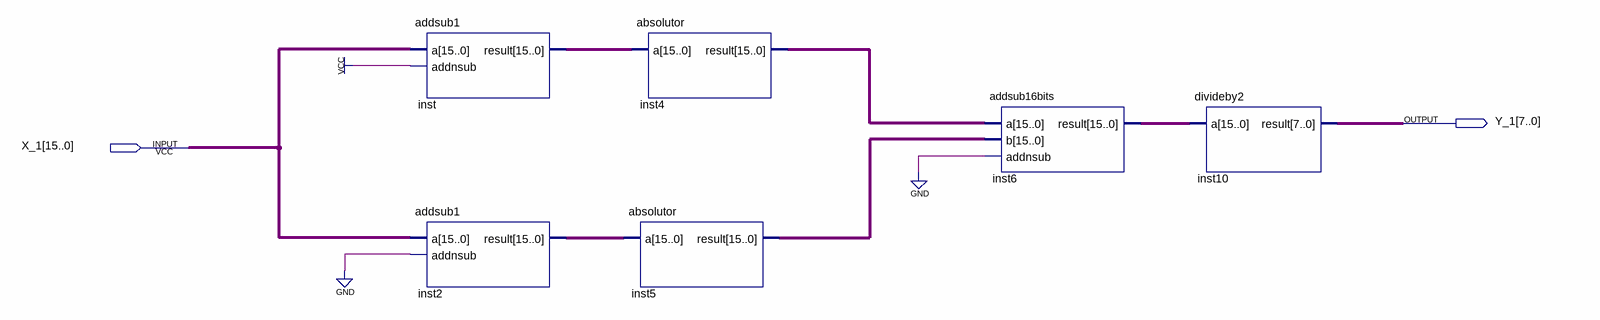
[diagram p0: schematic sheet]
// Quartus schematic Naive_EQ2.bdf as structural Verilog: 6 symbols, 2 pins
module Naive_EQ2 (
  input  [15:0] X_1,
  output [7:0] Y_1
);

  wire [15:0] inst2_result, inst4_result, inst5_result, inst6_result, inst_result;

  addsub1 inst (.a(X_1), .addnsub(1'b1), .result(inst_result));
  addsub1 inst2 (.a(X_1), .addnsub(1'b0), .result(inst2_result));
  absolutor inst4 (.a(inst_result), .result(inst4_result));
  absolutor inst5 (.a(inst2_result), .result(inst5_result));
  addsub16bits inst6 (.a(inst4_result), .b(inst5_result), .addnsub(1'b0), .result(inst6_result));
  divideby2 inst10 (.a(inst6_result), .result(Y_1));
endmodule
